# Altium schematic sheet PowerPCB.SchDoc
size A; SheetNumber: 1; SheetTotal: 1
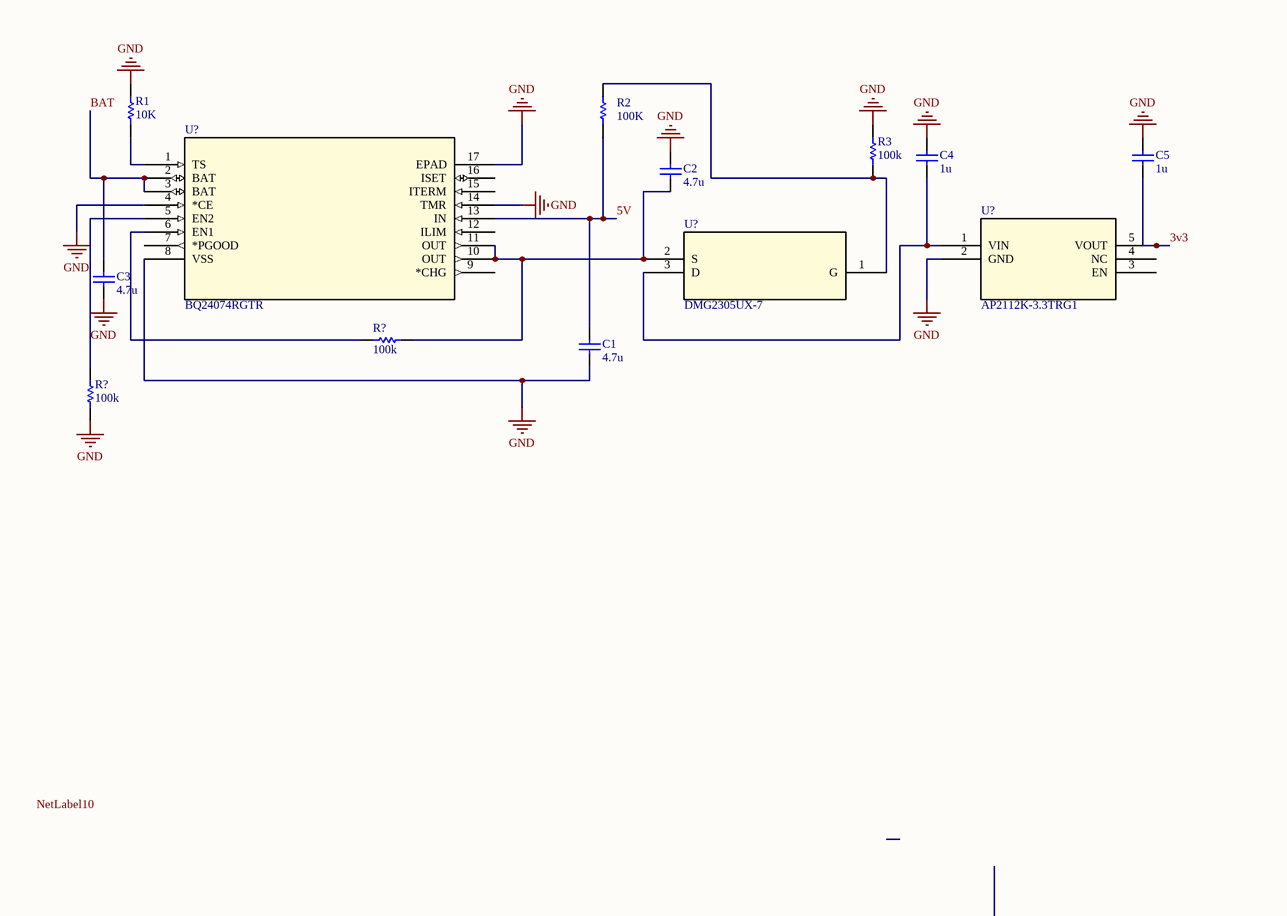
[diagram p0: PowerPCB.SchDoc, top left]
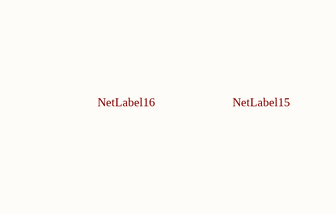
[diagram p1: PowerPCB.SchDoc, top right]

## Parts
(Parts that share a designator on the sheet are numbered #1, #2 ... from top to bottom, then left to right.)
C1  value 4.7u  (hidden comment: Capacitor)
C2  value 4.7u  (hidden comment: Capacitor)
C3  value 4.7u  (hidden comment: Capacitor)
C4  value 1u  (hidden comment: Capacitor)
C5  value 1u  (hidden comment: Capacitor)
R1  value 10K  (hidden comment: Resistor)
R2  value 100K  (hidden comment: Resistor)
R3  value 100k  (hidden comment: Resistor)
R?#1  value 100k  (hidden comment: Resistor)
R?#2  value 100k  (hidden comment: Resistor)
U?#1  BQ24074RGTR  [RGT16_1P7X1P7]
U?#2  AP2112K-3.3TRG1  [SOT_RG1_DIO]
U?#3  DMG2305UX-7  [SOT-23_DIO]

## Nets
GND: C1.1 C2.2 C3.1 C4.2 C5.2 R1.2 R3.2 R?#2.2 U?#1.4(*CE) U?#1.8(VSS) U?#1.14(TMR) U?#1.17(EPAD) U?#2.2(GND)
3v3: C5.1 U?#2.5(VOUT)
5V: C1.2 R2.2 U?#1.13(IN)
BAT: C3.2 U?#1.2(BAT) U?#1.3(BAT)
NetC2_1: C2.1 R?#1.1 U?#1.10(OUT) U?#1.11(OUT) U?#3.2(S)
NetC4_1: C4.1 U?#2.1(VIN) U?#3.3(D)
NetR1_1: R1.1 U?#1.1(TS)
NetR2_1: R2.1 R3.1 U?#3.1(G)
NetR?#1_2: R?#1.2 U?#1.6(EN1)
NetR?#2_1: R?#2.1 U?#1.5(EN2)

Not connected (* = marked no-connect by the designer): U?#1 7(*PGOOD) 9(*CHG) 12(ILIM) 15(ITERM) 16(ISET); U?#2 3(EN) 4(NC)

## Notes on the sheet
- Labels drawn without touching a wire or pin: NetLabel10, NetLabel15, NetLabel16, NetLabel20, NetLabel34, NetLabel35

## Library data of the parts
C1-C5 = Capacitor: SimulationGenericComponent: True
R1-R3 R?#1 R?#2 = Resistor: TC1: 0; SimulationGenericComponent: True; TC2: 0
U?#1 = BQ24074RGTR: Standalone 1-cell 1.5-A linear battery charger, Power Path, 4.2-V VBAT, 10.5-V OVP and 4.4-V VOUT 16-VQFN -40 to 85; Manufacturer_Name: Texas Instruments; Copyright: Copyright (C) 2025 Ultra Librarian. All rights reserved.; Manufacturer_Part_Number: BQ24074RGTR; RefDes: RefDes; Type: Type
U?#2 = AP2112K-3.3TRG1: Description; Manufacturer_Name: Diodes Inc; Copyright: Copyright (C) 2025 Ultra Librarian. All rights reserved.; Manufacturer_Part_Number: AP2112K-3.3TRG1; RefDes: RefDes; Type: Type
U?#3 = DMG2305UX-7: Description; Manufacturer_Name: Diodes Inc; Copyright: Copyright (C) 2025 Ultra Librarian. All rights reserved.; Manufacturer_Part_Number: DMG2305UX-7; RefDes: RefDes; Type: Type